# EAGLE design LEDActuatorJack (EAGLE 7.2.0)
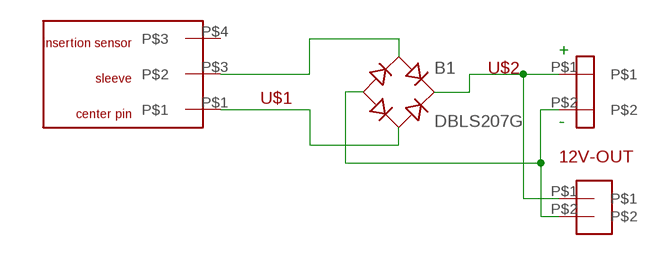
[diagram p0: schematic, sheet 1]

## Parts
12V-OUT  1X2HEADER_ROBBIE  [1X2HEADER_ROBBIE]
B1  DBLS207G  [DBS]
U$1  PJ-014CH-SMT  [PJ-014CH-SMT]
U$2  3.5MM_2PIN_SCREWTERMINAL_SPARKFUN  [1X02_3.5_SCREWTERM]

## Nets
N$1: B1.AC1 U$1.P$3
N$2: B1.AC2 U$1.P$1
N$3: 12V-OUT.P$1 B1.+ U$2.P$1
N$4: 12V-OUT.P$2 B1.- U$2.P$2
Unconnected: U$1.P$4

## Notes on the sheet
- +
- -

## Library data of the parts
12V-OUT = robbie:1X2HEADER_ROBBIE
B1 = rectifier:DB?*G: Single Phase 1.0 AMP Glass Passivated Bridge Rectifier Taiwan Semiconductor Co.,Ltd. - TSC Source: http://www.taiwansemi.com/TSCbig5/ezcatfiles/cust/img/img/db101g.pdf http://www.ts.com.tw/db/pictures/modules/PDT/PDT060207001/DBLS201G.pdf
U$1 = robbie:PJ-014CH-SMT
U$2 = robbie:3.5MM_2PIN_SCREWTERMINAL_SPARKFUN

## Board
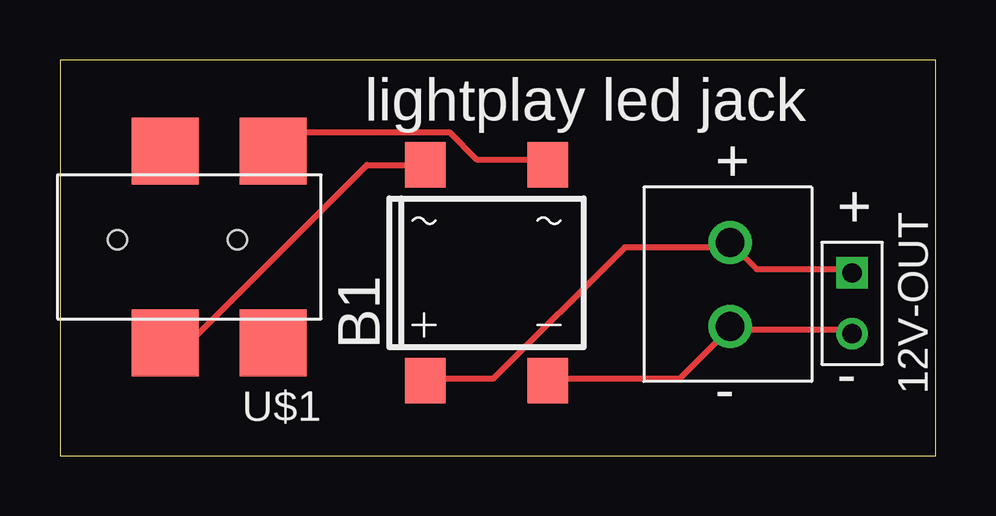
[diagram p1: board, top side]

Size 36.5 x 16.5 mm. Coordinates in mm from the lower left corner, seen from the top.
Outline: 0,0 36.5,0 36.5,16.5 0,16.5 0,0
Copper layers (1*16): Top 0.035mm / dielectric 1.5mm / Bottom 0.035mm
Design rules "default": minimum track width 10mil, minimum drill 24mil, track to track 8mil, track to pad 8mil, pad to pad 8mil, via to via 8mil, smd to smd 8mil, copper to edge 40mil, drill to drill 8mil, minimum pad ring 10mil, minimum via ring 8mil, stop-mask expansion 4mil, vias tented up to drill 0mil, thermal gap 10mil

### Footprints (pad centres in the part's own frame; a part is rotated, then mirrored left to right if it is on the bottom)
1X2HEADER_ROBBIE = drill 0.8 square: P$1 0,0 | drill 0.8: P$2 2.54,0
DBS = smd 1.7 x 1.9: + -2.55,-4.5; - 2.55,-4.5; AC1 -2.55,4.5; AC2 2.55,4.5
PJ-014CH-SMT = smd 2.8 x 2.8: P$1 0,0; P$2 4.5,0; P$3 4.5,8; P$4 0,8 | hole 0.8: 6.5,3.7; 1.5,3.7
1X02_3.5_SCREWTERM = drill 1.2: P$1 0,0; P$2 3.5,0

### Placement (x,y rotation side)
12V-OUT  33.02,7.62 270 top
B1  17.78,7.62 0 top
U$1  8.89,12.7 180 top
U$2  27.94,8.89 270 top

### Tracks (layer width: path | path; a pad name or v marks a point on that pad's centre or on a via)
N$1
  Top 0.254: B1.AC1 15.09,12.12 12.8,12.12 5.49,4.8 4.57,4.8 U$1.P$3
N$2
  Top 0.254: B1.AC2 20.12,12.34 17.37,12.34 16.23,13.49 9.6,13.49 8.91,12.8 U$1.P$1
N$3
  Top 0.254: B1.+ 15.32,3.2 18.06,3.2 23.55,8.69 27.89,8.69 U$2.P$1 28.12,8.69 29.03,7.77 32.92,7.77 12V-OUT.P$1
N$4
  Top 0.254: B1.- 20.34,3.2 25.83,3.2 27.89,5.26 U$2.P$2 28.12,5.26 32.92,5.26 12V-OUT.P$2

### Text on the board
tPlace: lightplay led jack | + | + | - | -